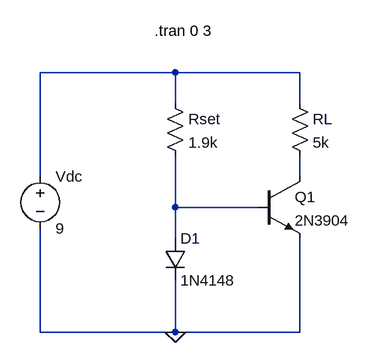
[diagram p0: schematic CurrentSource.asc]
CurrentSource.asc, the LTspice schematic file:
Version 4
SHEET 1 880 680
WIRE 240 80 32 80
WIRE 432 80 240 80
WIRE 240 128 240 80
WIRE 432 128 432 80
WIRE 32 240 32 80
WIRE 432 240 432 208
WIRE 240 288 240 208
WIRE 368 288 240 288
WIRE 240 336 240 288
WIRE 32 480 32 320
WIRE 240 480 240 400
WIRE 240 480 32 480
WIRE 432 480 432 336
WIRE 432 480 240 480
FLAG 240 480 0
SYMBOL npn 368 240 R0
SYMATTR InstName Q1
SYMATTR Value 2N3904
SYMBOL diode 224 336 R0
SYMATTR InstName D1
SYMATTR Value 1N4148
SYMBOL res 224 112 R0
SYMATTR InstName Rset
SYMATTR Value 1.9k
SYMBOL voltage 32 224 R0
SYMATTR InstName Vdc
SYMATTR Value 9
SYMBOL res 416 112 R0
SYMATTR InstName RL
SYMATTR Value 5k
TEXT 208 16 Left 2 !.tran 0 3

The netlist it stands for:
* CurrentSource.asc
Q1 N002 N003 0 0 2N3904
D1 N003 0 1N4148
Rset N001 N003 1.9k
Vdc N001 0 9
RL N001 N002 5k
.model D D
.lib standard.dio
.model NPN NPN
.model PNP PNP
.lib standard.bjt
.tran 0 3
.backanno
.end